# EAGLE design hall_sensor_test (EAGLE 8.2.0)
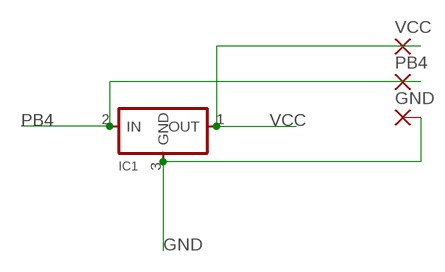
[diagram p0: schematic, sheet 1]

## Parts
GND  SMD2  [SMD1,27-2,54]
IC1  REGULATORSOT23  [SOT23]
PB4  SMD2  [SMD1,27-2,54]
VCC  SMD2  [SMD1,27-2,54]

## Nets
GND: GND.1(P) IC1.3(GND)
PB4: IC1.2(IN) PB4.1(P)
VCC: IC1.1(OUT) VCC.1(P)

## Library data of the parts
GND PB4 VCC = wirepad:SMD2: SMD PAD
IC1 = fab:REGULATOR

## Board
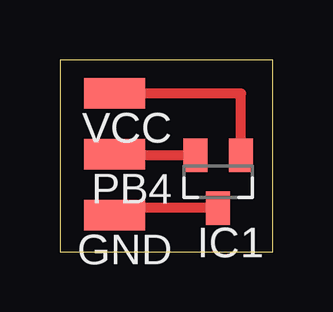
[diagram p1: board, top side]

Size 8.89 x 8 mm. Coordinates in mm from the lower left corner, seen from the top.
Outline: 0,0 8.89,0 8.89,8 0,8 0,0
Copper layers (1*16): Top 0.035mm / dielectric 1.5mm / Bottom 0.035mm
Design rules "guy_output *": minimum track width 16mil, minimum drill 0.35mm, track to track 0.6mm, track to pad 0.2mm, pad to pad 0.205mm, via to via 0.205mm, smd to smd 6mil, copper to edge 40mil, drill to drill 6mil, minimum pad ring 10mil, minimum via ring 8mil, stop-mask expansion 4mil, vias tented up to drill 0mil, thermal gap 10mil

### Footprints (pad centres in the part's own frame; a part is rotated, then mirrored left to right if it is on the bottom)
SMD1,27-2,54 = smd 1.27 x 2.54: 1 0,0
SOT23 = smd 1 x 1.4: 1 -0.95,-1.1; 2 0.95,-1.1; 3 0,1.1

### Placement (x,y rotation side)
GND  2.29,1.52 90 top
IC1  6.6,2.92 180 top
PB4  2.29,4.06 90 top
VCC  2.29,6.6 90 top

### Tracks (layer width: path | path; a pad name or v marks a point on that pad's centre or on a via)
GND
  Top 0.406: IC1.3 2.29,1.82 GND.1
PB4
  Top 0.406: IC1.2 2.29,4.02 PB4.1
VCC
  Top 0.406: IC1.1 7.55,6.6 VCC.1